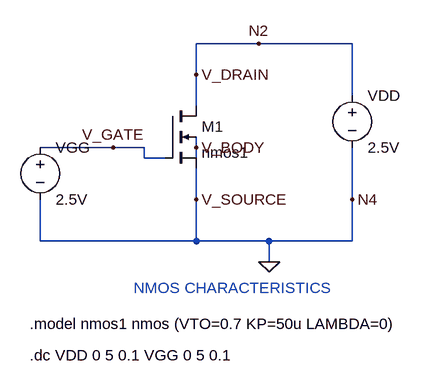
[diagram p0: schematic NMOS-CHAR.asc]
NMOS-CHAR.asc, the LTspice schematic file:
Version 4
SHEET 1 932 680
WIRE 416 96 320 96
WIRE 560 96 416 96
WIRE 320 144 320 96
WIRE 560 176 560 96
WIRE 320 192 320 144
WIRE 192 256 80 256
WIRE 240 256 192 256
WIRE 320 256 320 240
WIRE 240 272 240 256
WIRE 272 272 240 272
WIRE 320 272 320 256
WIRE 320 336 320 288
WIRE 560 336 560 256
WIRE 80 400 80 336
WIRE 320 400 320 336
WIRE 320 400 80 400
WIRE 432 400 320 400
WIRE 560 400 560 336
WIRE 560 400 432 400
WIRE 432 432 432 400
FLAG 432 432 0
FLAG 192 256 V_GATE
FLAG 416 96 N2
FLAG 560 336 N4
FLAG 320 144 V_DRAIN
FLAG 320 336 V_SOURCE
FLAG 320 256 V_BODY
SYMBOL nmos4 272 192 R0
SYMATTR InstName M1
SYMATTR Value nmos1
SYMATTR Value2 l=2u w=10u
SYMBOL voltage 560 160 R0
SYMATTR InstName VDD
SYMATTR Value 2.5V
SYMBOL voltage 80 240 R0
SYMATTR InstName VGG
SYMATTR Value 2.5V
TEXT 224 472 Left 2 ;NMOS CHARACTERISTICS
TEXT 64 528 Left 2 !.model nmos1 nmos (VTO=0.7 KP=50u LAMBDA=0)
TEXT 64 576 Left 2 !.dc VDD 0 5 0.1 VGG 0 5 0.1

The netlist it stands for:
* NMOS-CHAR.asc
M1 V_DRAIN V_GATE 0 V_BODY nmos1 l=2u w=10u
VDD V_DRAIN 0 2.5V
VGG V_GATE 0 2.5V
.model NMOS NMOS
.model PMOS PMOS
.lib standard.mos
* NMOS CHARACTERISTICS
.model nmos1 nmos (VTO=0.7 KP=50u LAMBDA=0)
.dc VDD 0 5 0.1 VGG 0 5 0.1
.backanno
.end